# EAGLE design MPU6050-IMU(I2C_V1) (EAGLE 6.5.0)
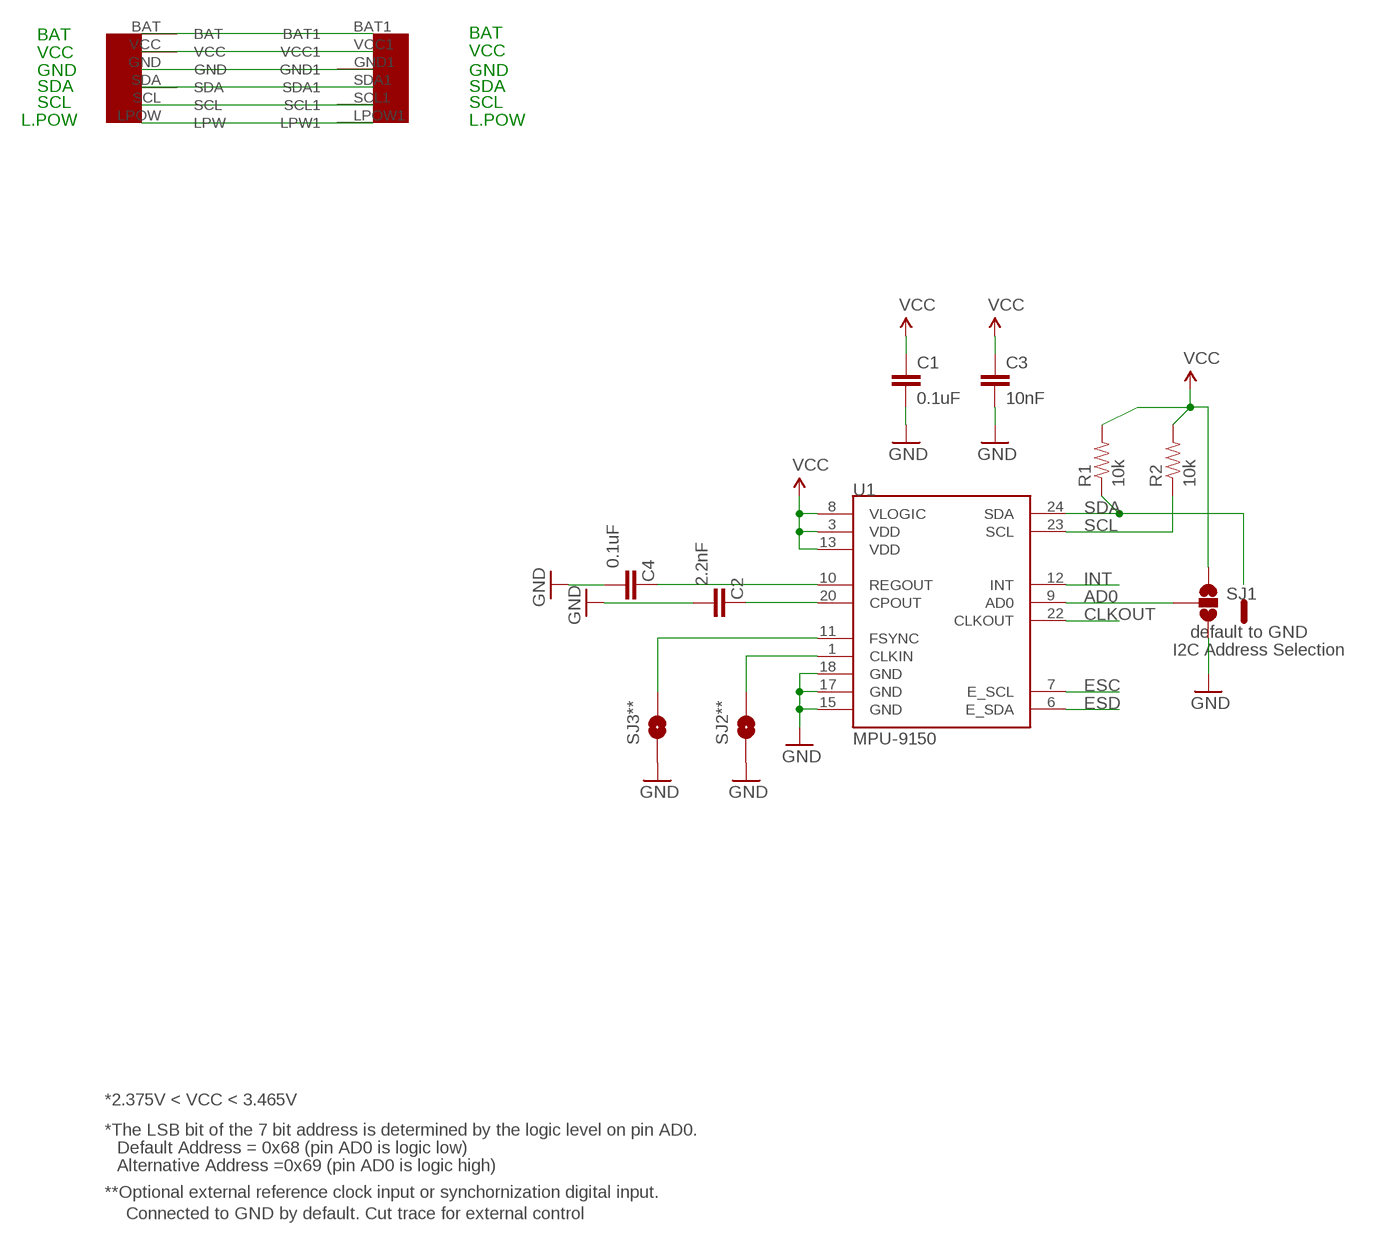
[diagram p0: schematic, sheet 1]

## Parts
C1  0.1uF  CAP0402-CAP  [0402-CAP]
C2  2.2nF  CAP0402-CAP  [0402-CAP]
C3  10nF  CAP0402-CAP  [0402-CAP]
C4  0.1uF  CAP0402-CAP  [0402-CAP]
R1  10k  RESISTOR0402-RES  [0402-RES]
R2  10k  RESISTOR0402-RES  [0402-RES]
SJ1  SOLDERJUMPER_2WAYPASTE2&3  [SJ_3_PASTE2&3]
SJ2**  SOLDERJUMPERTRACE  [SJ_2S-TRACE]
SJ3**  SOLDERJUMPERTRACE  [SJ_2S-TRACE]
U1  MPU-9150  MPU-9150QFN-24-NP  [QFN-24-NP]
U$1  EASYI2C6PINHEADER  [EASYI2C6PINHEADER]

## Nets
AD0: SJ1.2 U1.9(AD0)
BAT: U$1.BAT U$1.BAT1
CLKIN: SJ2**.2 U1.1(CLKIN)
CLKOUT: U1.22(CLKOUT)
ESC: U1.7(E_SCL)
ESD: U1.6(E_SDA)
FSYNC: SJ3**.2 U1.11(FSYNC)
GND: C1.2 C2.2 C3.2 C4.2 SJ1.3 SJ2**.1 SJ3**.1 U1.15(GND) U1.17(GND) U1.18(GND) U$1.GND U$1.GND1
INT: U1.12(INT)
N$1: C2.1 U1.20(CPOUT)
N$2: C4.1 U1.10(REGOUT)
N$6: U$1.LPOW1(LPW1) U$1.LPOW(LPW)
SCL: R2.1 U1.23(SCL) U$1.SCL U$1.SCL1
SDA: R1.1 U1.24(SDA) U$1.SDA U$1.SDA1
VCC: C1.1 C3.1 R1.2 R2.2 SJ1.1 U1.3(VDD) U1.8(VLOGIC) U1.13(VDD) U$1.VCC U$1.VCC1

## Notes on the sheet
- BAT | BAT
- VCC | VCC
- GND | GND
- SDA | SDA
- SCL | SCL
- L.POW | L.POW
- default to GND
- I2C Address Selection
- *2.375V < VCC < 3.465V
- *The LSB bit of the 7 bit address is determined by the logic level on pin AD0.
- Default Address = 0x68 (pin AD0 is logic low)
- Alternative Address =0x69 (pin AD0 is logic high)
- **Optional external reference clock input or synchornization digital input.
- Connected to GND by default. Cut trace for external control

## Library data of the parts
C1 C4 = SparkFun-Passives:CAP: Capacitor Standard 0603 ceramic capacitor, and 0.1" leaded capacitor.; MF: AVX; MPN: 02016D104KAT2A; OC_FARNELL: 1657913RL
C2 = SparkFun-Passives:CAP: Capacitor Standard 0603 ceramic capacitor, and 0.1" leaded capacitor.; MF: AVX; MPN: 06035C222KAT2A; OC_FARNELL: 498592
C3 = SparkFun-Passives:CAP: Capacitor Standard 0603 ceramic capacitor, and 0.1" leaded capacitor.; MF: AVX; MPN: 06035G103ZAT2A; OC_FARNELL: 317433
R1 R2 = SparkFun-Passives:RESISTOR: Resistor Basic schematic elements and footprints for 0603, 1206, and PTH resistors.; OC_FARNELL: unknown
SJ1 = SparkFun-Passives:SOLDERJUMPER_2WAY: Solder Jumper 2 way solder jumper; OC_FARNELL: unknown
SJ2** SJ3** = SparkFun-Passives:SOLDERJUMPER: Solder Jumper Standard SMD solder jumper. Used to automate production. Two varients : Normally Open and Normally Closed are the same, but have different paste layers. NC will have a large amount of paste and should jumper during reflow.; OC_FARNELL: unknown
U1 = SparkFun-Sensors:MPU-9150: 9DOF (3mag, 3accel, 3rotat). I2C interface.; OC_FARNELL: unknown
U$1 = UniqueInteractionsLib:EASYI2C6PINHEADER

## Board
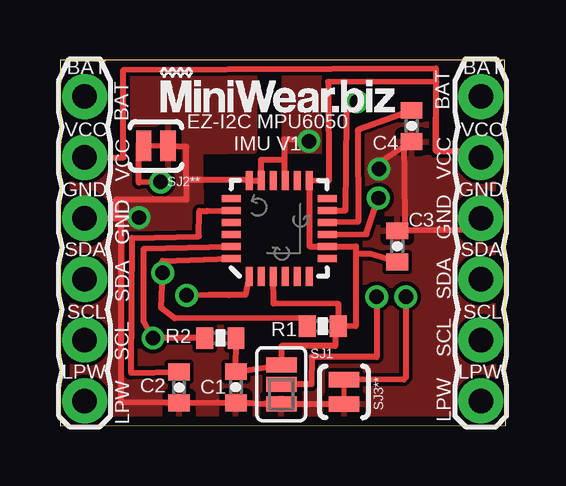
[diagram p1: board, top side]
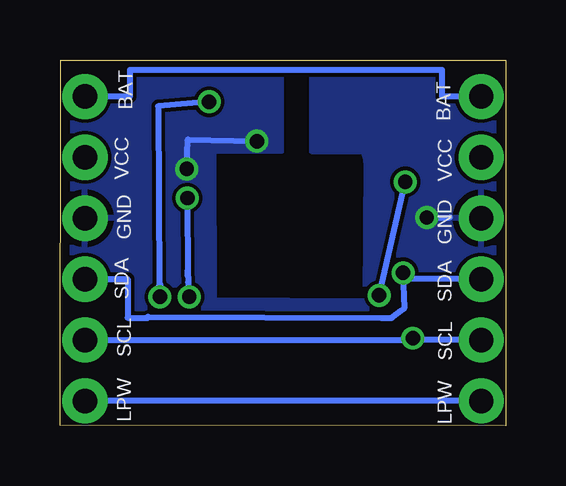
[diagram p2: board, bottom side, seen from below]

Size 18.57 x 15.25 mm. Coordinates in mm from the lower left corner, seen from the top.
Outline: 0.01,0 18.57,0.01 18.53,15.25 0,15.25 0.01,0
Copper layers (1*16): Top 0.0356mm / dielectric 1.5011mm / Bottom 0.0356mm
Design rules "oshParkPCBDesignRules": minimum track width 6mil, minimum drill 13mil, track to track 6mil, track to pad 6mil, pad to pad 6mil, via to via 6mil, smd to smd 6mil, copper to edge 15mil, drill to drill 6mil, minimum pad ring 7mil, minimum via ring 7mil, stop-mask expansion 3mil, vias tented up to drill 0mil, thermal gap 10mil

### Footprints (pad centres in the part's own frame; a part is rotated, then mirrored left to right if it is on the bottom)
0402-CAP = smd 0.7 x 0.9: 1 -0.65,0; 2 0.65,0
0402-RES = smd 0.7 x 0.9: 1 -0.65,0; 2 0.65,0
SJ_3_PASTE2&3 = smd 0.635 x 1.27: 1 -0.813,0; 2 0,0; 3 0.813,0
SJ_2S-TRACE = smd 0.635 x 1.27: 1 -0.508,0; 2 0.508,0
QFN-24-NP = smd 0.8 x 0.3: 1 -2,1.25; 2 -2,0.75; 3 -2,0.25; 4 -2,-0.25; 5 -2,-0.75; 6 -2,-1.25; 13 2,-1.25; 14 2,-0.75; 15 2,-0.25; 16 2,0.25; 17 2,0.75; 18 2,1.25 | smd 0.3 x 0.8: 7 -1.25,-2; 8 -0.75,-2; 9 -0.25,-2; 10 0.25,-2; 11 0.75,-2; 12 1.25,-2; 19 1.25,2; 20 0.75,2; 21 0.25,2; 22 -0.25,2; 23 -0.75,2; 24 -1.25,2
EASYI2C6PINHEADER = drill 1.016 pad 1.88: BAT 2.54,13.97; BAT1 19.05,13.97; GND 2.54,8.89; GND1 19.05,8.89; LPOW 2.54,1.27; LPOW1 19.05,1.27; SCL 2.54,3.81; SCL1 19.05,3.81; SDA 2.54,6.35; SDA1 19.05,6.35; VCC 2.54,11.43; VCC1 19.05,11.43

### Placement (x,y rotation side)
C1  7.33,1.6 270 top
C2  4.96,1.6 270 top
C3  14.05,7.48 90 top
C4  14.65,12.5 270 top
R1  10.95,4.15 0 top
R2  6.68,3.65 0 top
SJ1  9.22,1.73 270 top
SJ2**  3.99,11.67 180 top
SJ3**  11.84,1.41 90 top
U1  9.13,8.23 90 top
U$1  -1.52,-0.24 0 top
U$2  [LOGO2]  4.08,12.88 0 top

### Tracks (layer width: path | path; a pad name or v marks a point on that pad's centre or on a via)
AD0  (via drill 0.6 pad 0.25)
  Top 0.254: U1.9 12.76,7.99 v13.27,9.49 | v13.19,5.38 13.19,2.87 10.48,2.88 10.47,1.73 SJ1.2
  Bottom 0.254: v13.27,9.49 13.26,6.25 13.26,6.46 13.24,5.99 v13.19,5.38
BAT
  Bottom 0.254: U$1.BAT 2.65,13.73 2.65,14.83 15.66,14.83 15.66,13.73 U$1.BAT1
CLKIN  (via drill 0.6 pad 0.25)
  Top 0.254: U1.1 7.72,5.46 7.05,5.45 6.22,5.45 v5.28,5.44 | v4.19,10.17 3.29,10.14 3.29,11.78 SJ2**.2
  Bottom 0.254: v5.28,5.44 v4.19,10.17
FSYNC  (via drill 0.6 pad 0.25)
  Top 0.254: U1.11 11.9,8.98 11.95,12.87 11.95,13.55 v12.36,13.51 | v14.41,5.38 14.41,2.03 14.32,1.93 SJ3**.2
  Bottom 0.254: v12.36,13.51 14.48,13.32 14.44,5.83 14.39,5.88 v14.41,5.38
GND  (via drill 0.6)
  Top 0.254: SJ3**.1 SJ1.3 8.54,0.91 7.94,0.95 C1.2 6.57,0.97 C2.2 2.55,0.96 2.54,8.21 2.54,8.68 v3.29,8.68 2.33,8.68 | 5.26,10.23 U1.18 U1.17 8.38,11.09 9.35,11.09 | 5.26,10.23 5.26,11.62 SJ2**.1 | 9.35,11.09 9.35,10.23 U1.15 | v13.29,10.71 13.29,10.94 C4.2 14.35,11.85 14.38,8.68 14.38,8.13 C3.2 16.93,8.15 16.93,8.65 U$1.GND1 | v10.37,11.86 9.34,11.94 9.35,11.09 | 5.26,10.23 5.26,9.43 2.33,9.43 2.33,8.68 | U$1.GND 2.33,8.65 2.33,8.68
  Bottom 0.254: v13.29,10.71 13.25,11.94 v10.37,11.86 | v3.29,8.68 2.33,8.68
  pour Top: 18.25,-1.24 -0.23,-1.21 -0.2,15.31 8.09,15.27 8.09,11.46 5.85,11.41 5.89,5.17 12.2,5.22 12.14,11.44 9.36,11.46 9.36,15.27 18.37,15.43
  pour Bottom: 18.25,-1.24 -0.21,-1.23 -0.22,15.25 8.09,15.27 8.09,11.46 5.96,11.43 5.86,11.22 5.82,11 5.86,5.18 12.15,5.23 12.17,11.46 9.36,11.47 9.36,15.27 18.39,15.4
N$1
  Top 0.254: C2.1 2.95,2.21 2.99,7.83 5.79,7.89 5.81,8.96 6.15,8.96 U1.20
N$2
  Top 0.254: U1.10 12.42,8.5 12.41,12.24 12.45,12.36 C4.1
N$6
  Bottom 0.254: U$1.LPOW U$1.LPOW1
SCL  (via drill 0.6)
  Top 0.254: U1.23 3.49,7.38 3.49,4.35 v3.87,3.65 R2.1
  Bottom 0.254: U$1.SCL 3.87,3.57 | U$1.SCL1 3.87,3.57 | 3.87,3.57 v3.87,3.65
SDA  (via drill 0.6)
  Top 0.254: U1.24 4.26,6.87 v4.28,6.38 4.21,4.92 4.77,4.49 10.35,4.46 R1.1
  Bottom 0.254: U$1.SDA 4.28,6.11 v4.28,6.38 4.21,4.92 4.37,4.8 4.77,4.49 5.17,4.49 14.91,4.54 14.91,4.5 15.75,4.5 15.75,6.11 U$1.SDA1
VCC
  Top 0.254: R2.2 C1.1 SJ1.1 9.22,3.33 11.46,3.33 11.46,4.03 R1.2 | R1.2 11.61,4.36 11.61,5.07 8.91,5.1 U1.3 | 12.33,7.16 12.33,7.48 U1.8 10.39,7.48 U1.13 11.19,10.21 11.18,14.34 15.69,14.33 15.67,11.46 | 12.33,7.16 12.31,4.14 R1.2 | C3.1 12.95,7.16 12.33,7.16 | 15.67,11.46 15.67,14.91 2.64,14.85 2.64,11.19 U$1.VCC | 15.67,11.46 16.98,11.46 16.98,11.19 U$1.VCC1

### Text on the board
tNames: EZ-I2C MPU6050 / IMU V1